# Altium schematic sheet AUDIO_AMP_NB2C.SchDoc: AUDIO SUB-SYSTEM
size A4; Organization: Altium Limited.; Address1: 3 Minna Close; Address2: Belrose; Address3: NSW 2085; Address4: AUSTRALIA; DocumentNumber: 16; SheetNumber: 17; SheetTotal: 78; PageSetup: Record=PageOptions|CenterHorizontal=True|CenterVertical=True|PrintScale=0.97|XCorrection=1.00|YCorrection=1.00|PrintKind=0|BorderSize=5000000|LeftOffset=0|BottomOffset=0|Orientation=2|PaperLength=1000|PaperWidth=1000|Scale=100|PaperSource=7|PrintQuality=-4|MediaType=1|DitherType=10|PaperKind=A4 (210 x 297 mm)|PrintScaleMode=1
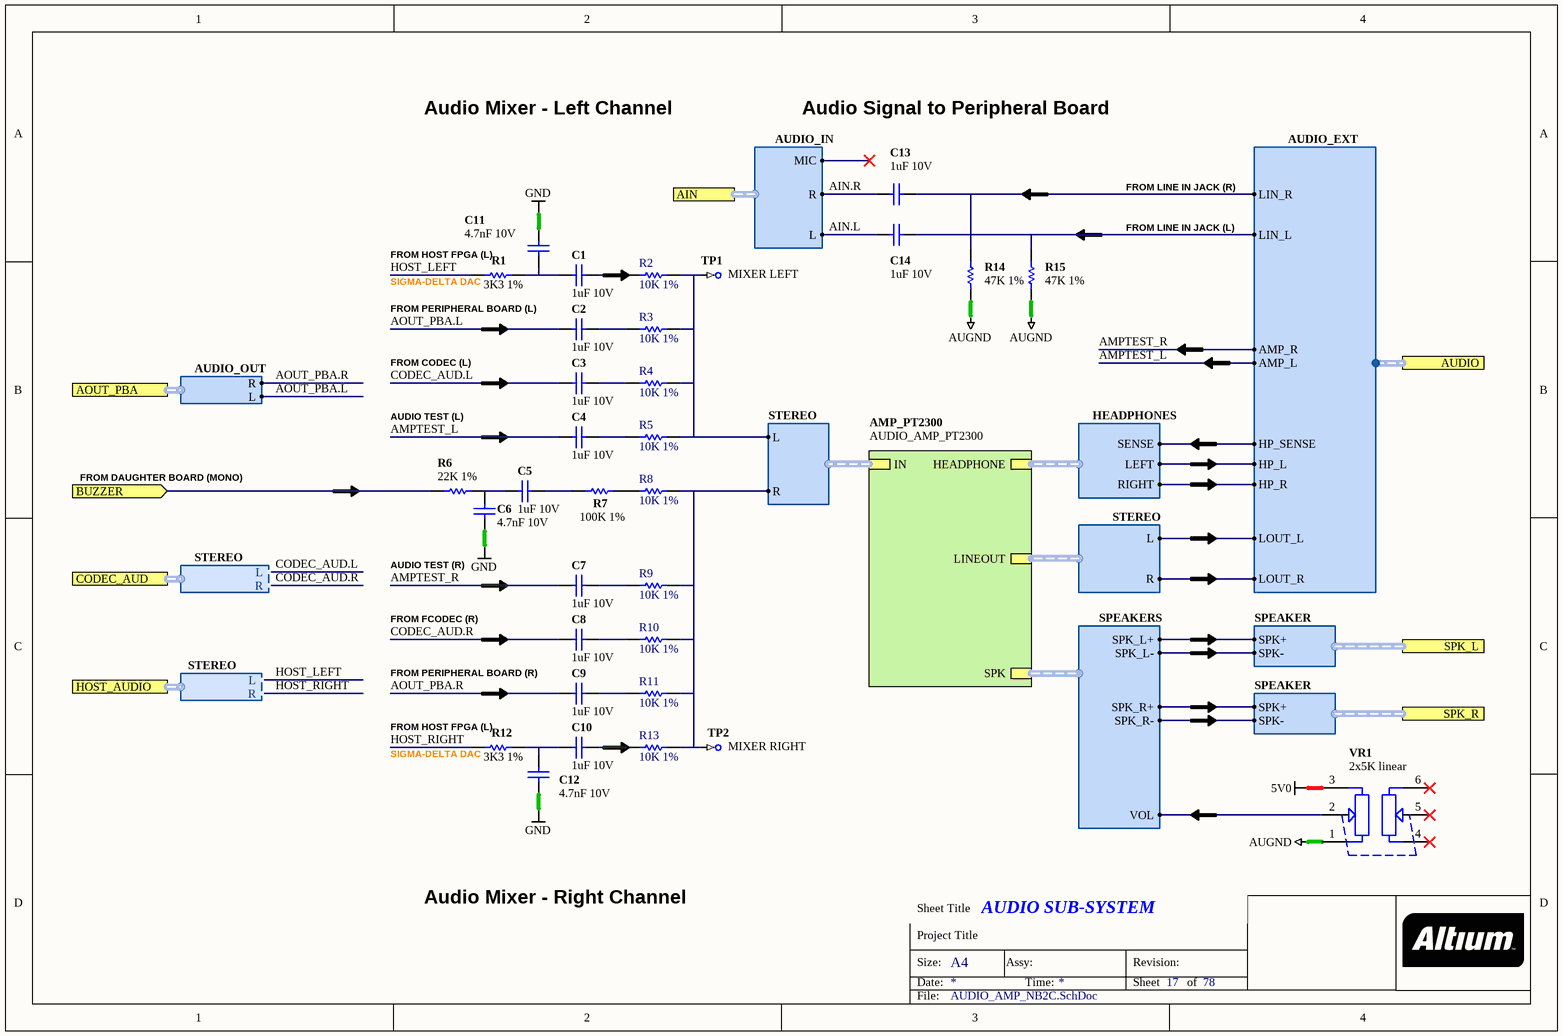
[diagram p0: AUDIO_AMP_NB2C.SchDoc]

## Parts
C1  1uF 10V  [CAPC1005-STAR]
C2  1uF 10V  [CAPC1005-STAR]
C3  1uF 10V  [CAPC1005-STAR]
C4  1uF 10V  [CAPC1005-STAR]
C5  1uF 10V  [CAPC1005-STAR]
C6  4.7nF 10V  [CAPC1005-STAR]
C7  1uF 10V  [CAPC1005-STAR]
C8  1uF 10V  [CAPC1005-STAR]
C9  1uF 10V  [CAPC1005-STAR]
C10  1uF 10V  [CAPC1005-STAR]
C11  4.7nF 10V  [CAPC1005-STAR]
C12  4.7nF 10V  [CAPC1005-STAR]
C13  1uF 10V  [CAPC1005-STAR]
C14  1uF 10V  [CAPC1005-STAR]
R1  3K3 1%  [RESC1005-STAR]
R2  10K 1%  [RESC1005-STAR]
R3  10K 1%  [RESC1005-STAR]
R4  10K 1%  [RESC1005-STAR]
R5  10K 1%  [RESC1005-STAR]
R6  22K 1%  [RESC1005-STAR]
R7  100K 1%  [RESC1005-STAR]
R8  10K 1%  [RESC1005-STAR]
R9  10K 1%  [RESC1005-STAR]
R10  10K 1%  [RESC1005-STAR]
R11  10K 1%  [RESC1005-STAR]
R12  3K3 1%  [RESC1005-STAR]
R13  10K 1%  [RESC1005-STAR]
R14  47K 1%  [RESC1005-STAR]
R15  47K 1%  [RESC1005-STAR]
TP1  MIXER LEFT  [TestPin]  (no BOM)
TP2  MIXER RIGHT  [TestPin]  (no BOM)
VR1  2x5K linear  [POT-R0911G-A1]

## Sub-sheets
AMP_PT2300 = AUDIO_AMP_PT2300: SPK (harness SPEAKERS), IN (harness STEREO), LINEOUT (harness STEREO), HEADPHONE (harness HEADPHONES)

## Ports
AIN (harness AUDIO_IN), AOUT_PBA (harness AUDIO_OUT), AUDIO (harness AUDIO_EXT), BUZZER (in), CODEC_AUD (harness STEREO), HOST_AUDIO (harness STEREO), SPK_L (harness SPEAKER), SPK_R (harness SPEAKER)

## Harnesses
AUDIO_EXT: AMP_L, AMP_R, HP_L, HP_R, HP_SENSE, LIN_L, LIN_R, LOUT_L, LOUT_R
STEREO: R, L
HEADPHONES: RIGHT, LEFT, SENSE
SPEAKER: SPK-, SPK+
SPEAKERS: SPK_L-, SPK_L+, SPK_R-, SPK_R+, VOL
AUDIO_IN: L, R, MIC
STEREO: L, R
AUDIO_OUT: L, R

## Nets
5V0: VR1.3
AUGND: R14.1 R15.1 VR1.1
GND: C6.2 C11.2 C12.2
AIN.L: C14.2 ; port AIN.L
AIN.R: C13.2 ; port AIN.R
AMPTEST_L: C4.2 ; port AUDIO.AMP_L
AMPTEST_R: C7.2 ; port AUDIO.AMP_R
AOUT_PBA.L: C2.2 ; port AOUT_PBA.L
AOUT_PBA.R: C9.2 ; port AOUT_PBA.R
BUZZER: R6.1 ; port BUZZER
CODEC_AUD.L: C3.2 ; port CODEC_AUD.L
CODEC_AUD.R: C8.2 ; port CODEC_AUD.R
HOST_LEFT: R1.1 ; port HOST_AUDIO.L
HOST_RIGHT: R12.1 ; port HOST_AUDIO.R
NetC1_1: C1.1 R2.1
NetC1_2: C1.2 C11.1 R1.2
NetC2_1: C2.1 R3.1
NetC3_1: C3.1 R4.1
NetC4_1: C4.1 R5.1
NetC5_1: C5.1 R7.1
NetC5_2: C5.2 C6.1 R6.2
NetC7_1: C7.1 R9.1
NetC8_1: C8.1 R10.1
NetC9_1: C9.1 R11.1
NetC10_1: C10.1 R13.1
NetC10_2: C10.2 C12.1 R12.2
NetC13_1: C13.1 R14.2 ; port AUDIO.LIN_R
NetC14_1: C14.1 R15.2 ; port AUDIO.LIN_L
NetR2_2: R2.2 R3.2 R4.2 R5.2 TP1.1 ; sheet AMP_PT2300/IN.L
NetR7_2: R7.2 R8.1
NetR8_2: R8.2 R9.2 R10.2 R11.2 R13.2 TP2.1 ; sheet AMP_PT2300/IN.R
NetVR1_2: VR1.2 ; sheet AMP_PT2300/SPK.VOL
(unnamed): port AUDIO.HP_L, sheet AMP_PT2300/HEADPHONE.LEFT
(unnamed): port AUDIO.HP_R, sheet AMP_PT2300/HEADPHONE.RIGHT
(unnamed): port AUDIO.HP_SENSE, sheet AMP_PT2300/HEADPHONE.SENSE
(unnamed): port AUDIO.LOUT_L, sheet AMP_PT2300/LINEOUT.L
(unnamed): port AUDIO.LOUT_R, sheet AMP_PT2300/LINEOUT.R
(unnamed): port SPK_L.SPK-, sheet AMP_PT2300/SPK.SPK_L-
(unnamed): port SPK_L.SPK+, sheet AMP_PT2300/SPK.SPK_L+
(unnamed): sheet AMP_PT2300/SPK.SPK_R-, port SPK_R.SPK-
(unnamed): sheet AMP_PT2300/SPK.SPK_R+, port SPK_R.SPK+

Not connected (* = marked no-connect by the designer): VR1 4* 5* 6*

## Notes on the sheet
- Audio Mixer - Left Channel
- Audio Signal to Peripheral Board
- FROM LINE IN JACK (R)
- FROM LINE IN JACK (L)
- (near R1) FROM PERIPHERAL BOARD (L)
- (near R1) FROM HOST FPGA (L)
- (near R1) SIGMA-DELTA DAC
- FROM CODEC (L)
- AUDIO TEST (L)
- FROM DAUGHTER BOARD (MONO)
- AUDIO TEST (R)
- FROM FCODEC (R)
- FROM PERIPHERAL BOARD (R)
- (near R12) FROM HOST FPGA (L)
- (near R12) SIGMA-DELTA DAC
- Audio Mixer - Right Channel
- Sheet Title
- Project Title
- Size:
- Date:
- A4
- Assy:
- Time:
- Revision:
- Sheet
- of
- File:

## Library data of the parts
C1-C5 C7-C10 C13 C14 = D-101-0131: Capacitor, Ceramic, 1uF 10% 10V 0402 (1005) X5R; Polarity: Non-Polarized; Category: Capacitor; Capacitance: 1 uF; Dielectric: X5R; Mounting Technology: Surface Mount; Rated Voltage: 10 V; Status: Unreleased; Technology: None; Tolerance: 10 %
C6 C11 C12 = D-101-0132: Capacitor, Ceramic, 4.7nF 10% 10V 0402 (1005) X7R; Polarity: Non-Polarized; Category: Capacitor; Dielectric: X7R; Mounting Technology: Surface Mount; Status: Production; Technology: Ceramic
  C6: Capacitance: 4.7 nF; Rated Voltage: 10 V; Tolerance: 10 %
  C11 C12: Capacitance: 4.7nF; Rated Voltage: 10V; Tolerance: 10%
R1 R12 = D-100-0098: Resistor, 3K3 1% 0402 (1005); Power Rating: 63 mW; Resistance: 3.3 K; Category: Resistor; Mounting Technology: Surface Mount; Status: Production; Tolerance: 1 %
R2-R5 R8-R11 R13 = D-100-0130: Resistor, 10K 1% 0402 (1005); Power Rating: 63mW; Category: Resistor; Mounting Technology: Surface Mount; Resistance: 10K; Status: Production; Tolerance: 1%
R6 = D-100-0114: Resistor, 22K 1% 0402 (1005); Power Rating: mW; Category: Resistor; Mounting Technology: Surface Mount; Resistance: 22 K; Status: Production; Tolerance: 1 %
R7 = D-100-0132: Resistor, 100K 1% 0402 (1005); Power Rating: 63 mW; Category: Resistor; Mounting Technology: Surface Mount; Resistance: 100 K; Status: Production; Tolerance: 1 %
R14 R15 = D-100-0092: Resistor, 47K 1% 0402 (1005); Power Rating: 63 mW; Category: Resistor; Mounting Technology: Surface Mount; Resistance: 47 K; Status: Production; Tolerance: 1 %
TP1 TP2 = D-006-0000: Test Point, PCB Mount with Silkscreen Box; Category: Test-Point; Status: Production
VR1 = D-105-0001: Potentiometer, 2 x 5K Linear 9mm PCB Mount Fluted Shaft; Category: Potentiometer; Status: Production